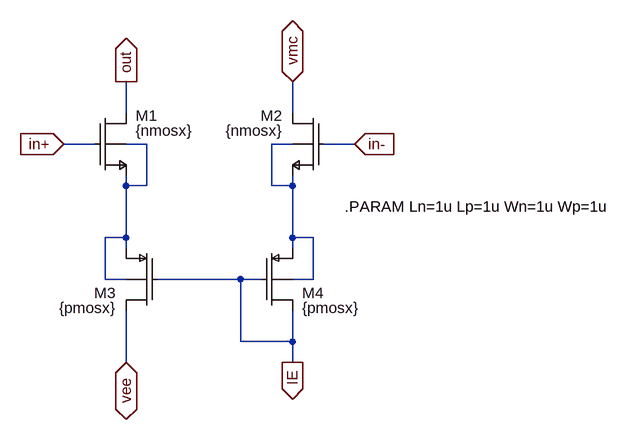
[diagram p0: schematic exp_N_mos.asc]
exp_N_mos.asc, the LTspice schematic file:
Version 4
SHEET 1 2340 808
WIRE 864 64 864 16
WIRE 1120 64 1120 16
WIRE 816 112 768 112
WIRE 896 112 864 112
WIRE 1120 112 1088 112
WIRE 1216 112 1168 112
WIRE 864 176 864 160
WIRE 896 176 896 112
WIRE 896 176 864 176
WIRE 1088 176 1088 112
WIRE 1120 176 1120 160
WIRE 1120 176 1088 176
WIRE 864 256 864 176
WIRE 864 256 832 256
WIRE 1120 256 1120 176
WIRE 1152 256 1120 256
WIRE 864 272 864 256
WIRE 1120 272 1120 256
WIRE 832 320 832 256
WIRE 864 320 832 320
WIRE 1040 320 912 320
WIRE 1072 320 1040 320
WIRE 1152 320 1152 256
WIRE 1152 320 1120 320
WIRE 1040 416 1040 320
WIRE 1120 416 1120 368
WIRE 1120 416 1040 416
WIRE 864 448 864 368
WIRE 1120 448 1120 416
FLAG 864 448 vee
IOPIN 864 448 BiDir
FLAG 864 16 out
IOPIN 864 16 Out
FLAG 1120 448 IE
IOPIN 1120 448 Out
FLAG 768 112 in+
IOPIN 768 112 In
FLAG 1216 112 in-
IOPIN 1216 112 In
FLAG 1120 16 vmc
IOPIN 1120 16 BiDir
SYMBOL pmosb 912 272 M0
SYMATTR InstName M3
SYMATTR Value {pmosx}
SYMATTR Value2 l={Lp} w={Wp} ad={Wp*0.2u} as={Wp*0.2u} pd={(Wp+0.2u)*2} ps={(Wp+0.2u)*2} m=1
SYMBOL pmosb 1072 272 R0
SYMATTR InstName M4
SYMATTR Value {pmosx}
SYMATTR Value2 l={Lp} w={Wp} ad={Wp*0.2u} as={Wp*0.2u} pd={(Wp+0.2u)*2} ps={(Wp+0.2u)*2} m=1
SYMBOL nmosb 816 64 R0
SYMATTR InstName M1
SYMATTR Value {nmosx}
SYMATTR Value2 l={Ln} w={Wn} ad={Wn*0.2u} as={Wn*0.2u} pd={(Wn+0.2u)*2} ps={(Wn+0.2u)*2} m=1
SYMBOL nmosb 1168 64 M0
SYMATTR InstName M2
SYMATTR Value {nmosx}
SYMATTR Value2 l={Ln} w={Wn} ad={Wn*0.2u} as={Wn*0.2u} pd={(Wn+0.2u)*2} ps={(Wn+0.2u)*2} m=1
TEXT 1200 208 Left 2 !.PARAM Ln=1u Lp=1u Wn=1u Wp=1u

The netlist it stands for:
* exp_N_mos.asc
M3 vee IE N001 N001 {pmosx} l={Lp} w={Wp} ad={Wp*0.2u} as={Wp*0.2u} pd={(Wp+0.2u)*2} ps={(Wp+0.2u)*2} m=1
M4 IE IE N002 N002 {pmosx} l={Lp} w={Wp} ad={Wp*0.2u} as={Wp*0.2u} pd={(Wp+0.2u)*2} ps={(Wp+0.2u)*2} m=1
M1 out in+ N001 N001 {nmosx} l={Ln} w={Wn} ad={Wn*0.2u} as={Wn*0.2u} pd={(Wn+0.2u)*2} ps={(Wn+0.2u)*2} m=1
M2 vmc in- N002 N002 {nmosx} l={Ln} w={Wn} ad={Wn*0.2u} as={Wn*0.2u} pd={(Wn+0.2u)*2} ps={(Wn+0.2u)*2} m=1
.model NMOS NMOS
.model PMOS PMOS
.lib standard.mos
.PARAM Ln=1u Lp=1u Wn=1u Wp=1u
.backanno
.end